# Altium schematic sheet Top_Level.SchDoc
size A
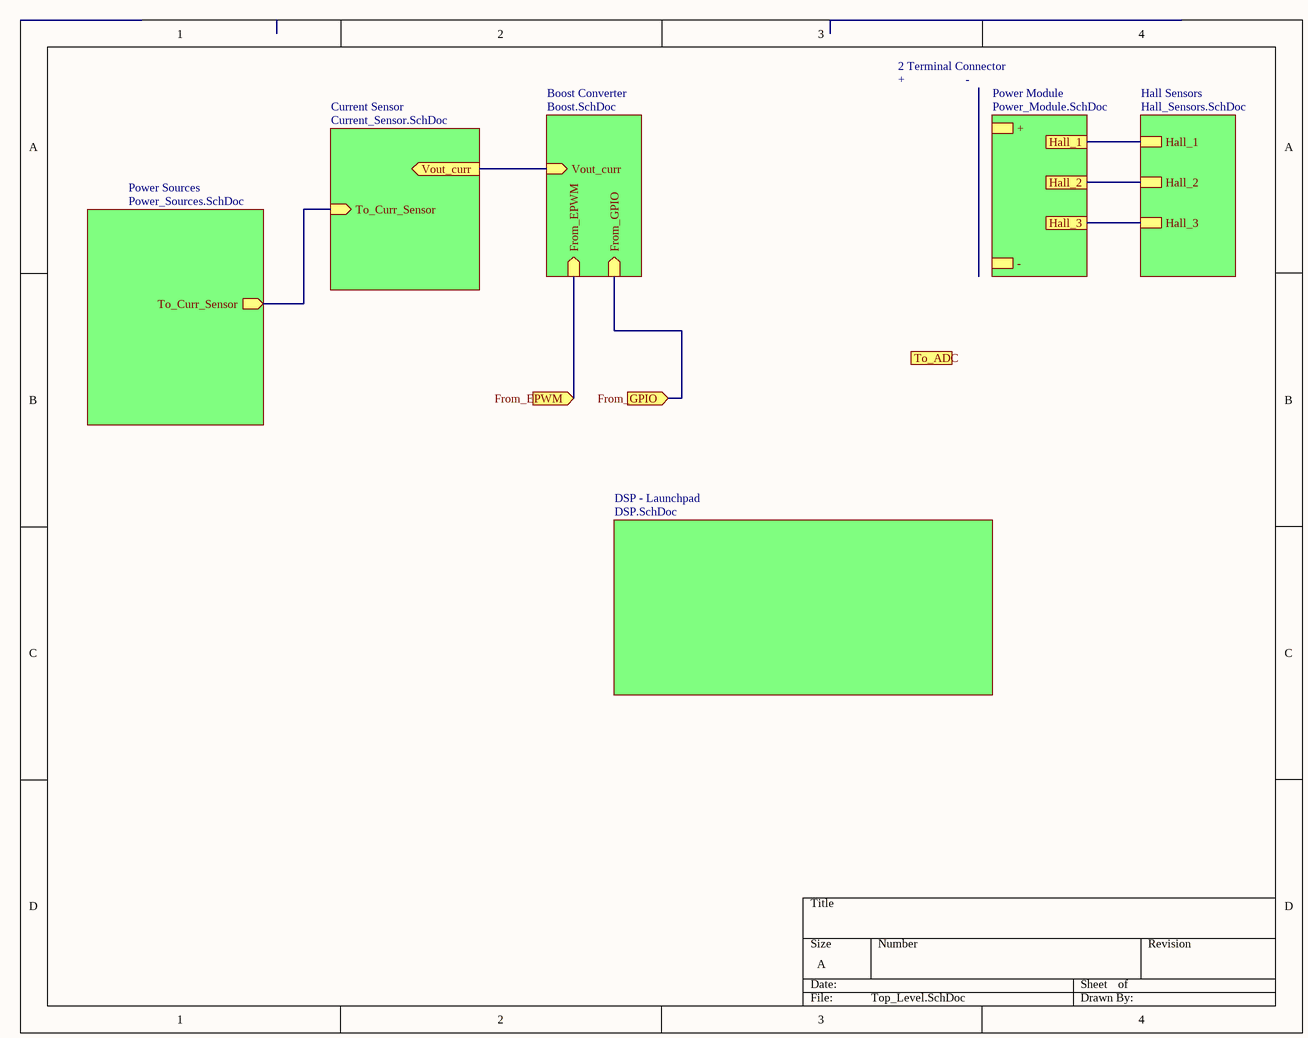
[diagram p0: Top_Level.SchDoc]

## Sub-sheets
Boost Converter = Boost.SchDoc: From_EPWM (in), From_GPIO (in), Vout_curr (in)
Current Sensor = Current_Sensor.SchDoc: To_Curr_Sensor (in)
DSP - Launchpad = DSP.SchDoc: no entries
Hall Sensors = Hall_Sensors.SchDoc: Hall_1, Hall_2, Hall_3
Power Module = Power_Module.SchDoc: +, -
Power Sources = Power_Sources.SchDoc: To_Curr_Sensor (out)

## Ports
From_EPWM (in), From_GPIO (in), Hall_1, Hall_2, Hall_3, To_ADC (out), Vout_curr (out)

## Nets
From_EPWM: port From_EPWM, sheet Boost Converter/From_EPWM
From_GPIO: port From_GPIO, sheet Boost Converter/From_GPIO
Hall_1: port Hall_1, sheet Hall Sensors/Hall_1
Hall_2: port Hall_2, sheet Hall Sensors/Hall_2
Hall_3: port Hall_3, sheet Hall Sensors/Hall_3
Vout_curr: port Vout_curr, sheet Boost Converter/Vout_curr
(unnamed): sheet Power Sources/To_Curr_Sensor, sheet Current Sensor/To_Curr_Sensor

## Notes on the sheet
- 2 Terminal Connector
- +
- -